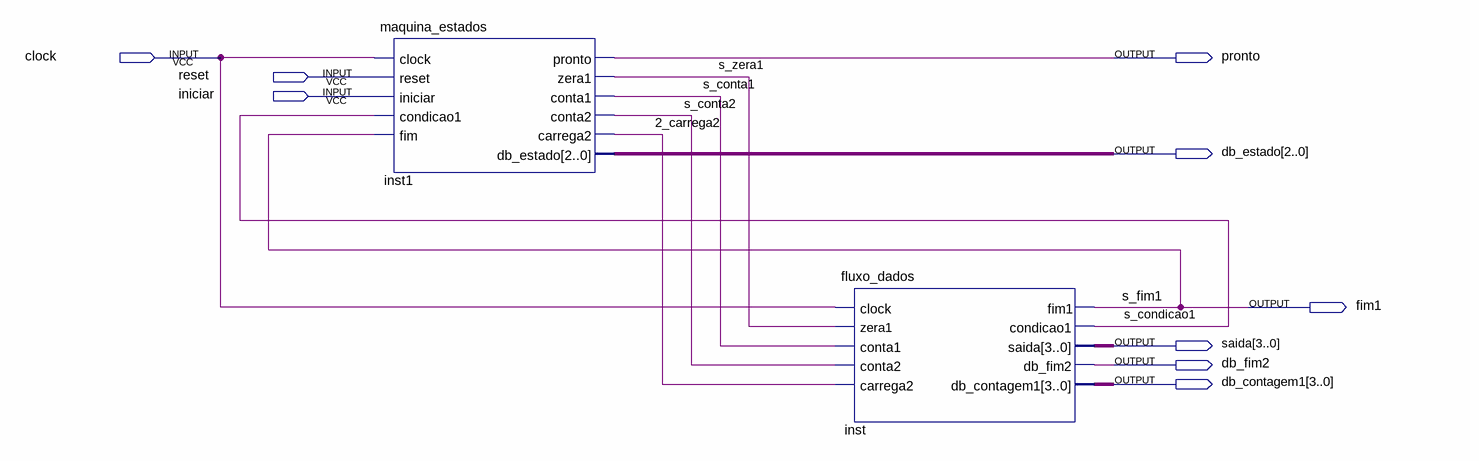
[diagram p0: schematic sheet]
// Quartus schematic circuito4.bdf as structural Verilog: 2 symbols, 9 pins
module circuito4 (
  input  clock,
  input  reset,
  input  iniciar,
  output pronto,
  output [2:0] db_estado,
  output fim1,
  output [3:0] saida,
  output db_fim2,
  output [3:0] db_contagem1
);

  wire \2_carrega2 , s_condicao1, s_conta1, s_conta2, s_zera1;

  maquina_estados inst1 (
    .clock(clock), .reset(reset), .iniciar(iniciar), .condicao1(s_condicao1), .fim(fim1), .pronto(pronto),
    .zera1(s_zera1), .conta1(s_conta1), .conta2(s_conta2), .carrega2(\2_carrega2 ), .db_estado(db_estado));
  fluxo_dados inst (
    .clock(clock), .zera1(s_zera1), .conta1(s_conta1), .conta2(s_conta2), .carrega2(\2_carrega2 ),
    .fim1(fim1), .condicao1(s_condicao1), .saida(saida), .db_fim2(db_fim2), .db_contagem1(db_contagem1));

  // Other names for the same wires on the sheet: s_fim1 = fim1
endmodule
